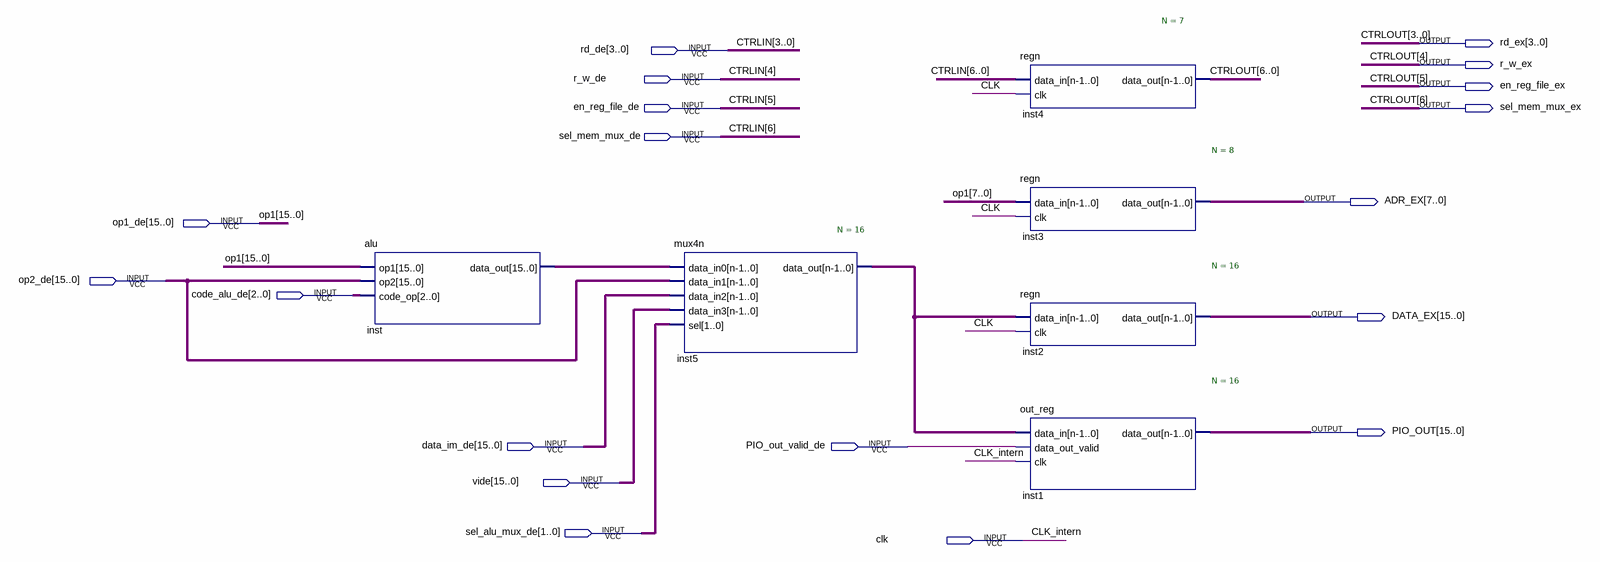
[diagram p0: schematic sheet]
// Quartus schematic execstage.bdf as structural Verilog: 6 symbols, 19 pins
module execstage (
  input  [3:0] rd_de,
  input  r_w_de,
  input  en_reg_file_de,
  input  sel_mem_mux_de,
  input  [15:0] op1_de,
  input  [15:0] op2_de,
  input  [2:0] code_alu_de,
  input  [15:0] data_im_de,
  input  PIO_out_valid_de,
  input  [15:0] vide,
  input  [1:0] sel_alu_mux_de,
  input  clk,
  output [3:0] rd_ex,
  output r_w_ex,
  output en_reg_file_ex,
  output sel_mem_mux_ex,
  output [7:0] ADR_EX,
  output [15:0] DATA_EX,
  output [15:0] PIO_OUT
);

  wire [15:0] inst5_data_out, inst_data_out;

  alu inst (.op1(op1_de), .op2(op2_de), .code_op(code_alu_de), .data_out(inst_data_out));
  mux4n #(.N(16)) inst5 (
    .data_in0(inst_data_out), .data_in1(op2_de), .data_in2(data_im_de), .data_in3(vide),
    .sel(sel_alu_mux_de), .data_out(inst5_data_out));
  regn #(.N(7)) inst4 (
    .data_in({sel_mem_mux_de, en_reg_file_de, r_w_de, rd_de}), .clk(clk),
    .data_out({sel_mem_mux_ex, en_reg_file_ex, r_w_ex, rd_ex}));
  regn #(.N(8)) inst3 (.data_in(op1_de[7:0]), .clk(clk), .data_out(ADR_EX));
  regn #(.N(16)) inst2 (.data_in(inst5_data_out), .clk(clk), .data_out(DATA_EX));
  out_reg #(.N(16)) inst1 (.data_in(inst5_data_out), .data_out_valid(PIO_out_valid_de), .clk(clk), .data_out(PIO_OUT));

  // Other names for the same wires on the sheet: CLK_intern = clk;
  //   CTRLIN[6:0] = {sel_mem_mux_de, en_reg_file_de, r_w_de, rd_de};
  //   CTRLOUT[6:0] = {sel_mem_mux_ex, en_reg_file_ex, r_w_ex, rd_ex}; op1[15:0] = op1_de
endmodule
